# Altium schematic sheet Cover.SchDoc
size A3; SheetNumber: 1; SheetTotal: 6
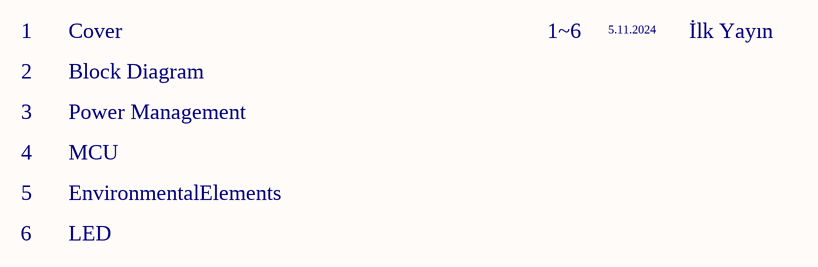
[diagram p0: Cover.SchDoc]

## Notes on the sheet
- 1
- 2
- Cover
- Block Diagram
- 1~6
- 5.11.2024
- İlk Yayın
- 3
- 4
- Power Management
- MCU
- 5
- EnvironmentalElements
- 6
- LED
- İÇİNDEKİLER / CONTENTS
- REVİZYON / REVISION
- ÜRETİM NOTLARI / PRODUCTION NOTES
- Sayfa Nu.
- Page No
- Açıklama / Description
- Tarih
- Date
- Board Features
- Kart Özellikleri
- Üretim Çıktıları
- Gerber Files
- Ekler
- Attachments
- İLETİŞİM / CONTACT
- DOSYA ADI / FILE NAME
- TANIM / DESCRIPTION
- HAZIRLAYAN / PREPARED BY
- YAYIN TARİHİ / REL. DATE
- BOYUT / SIZE
- SAYFA / SHEET
- /